# EAGLE board TRS-80 (EAGLE 6.6.0)
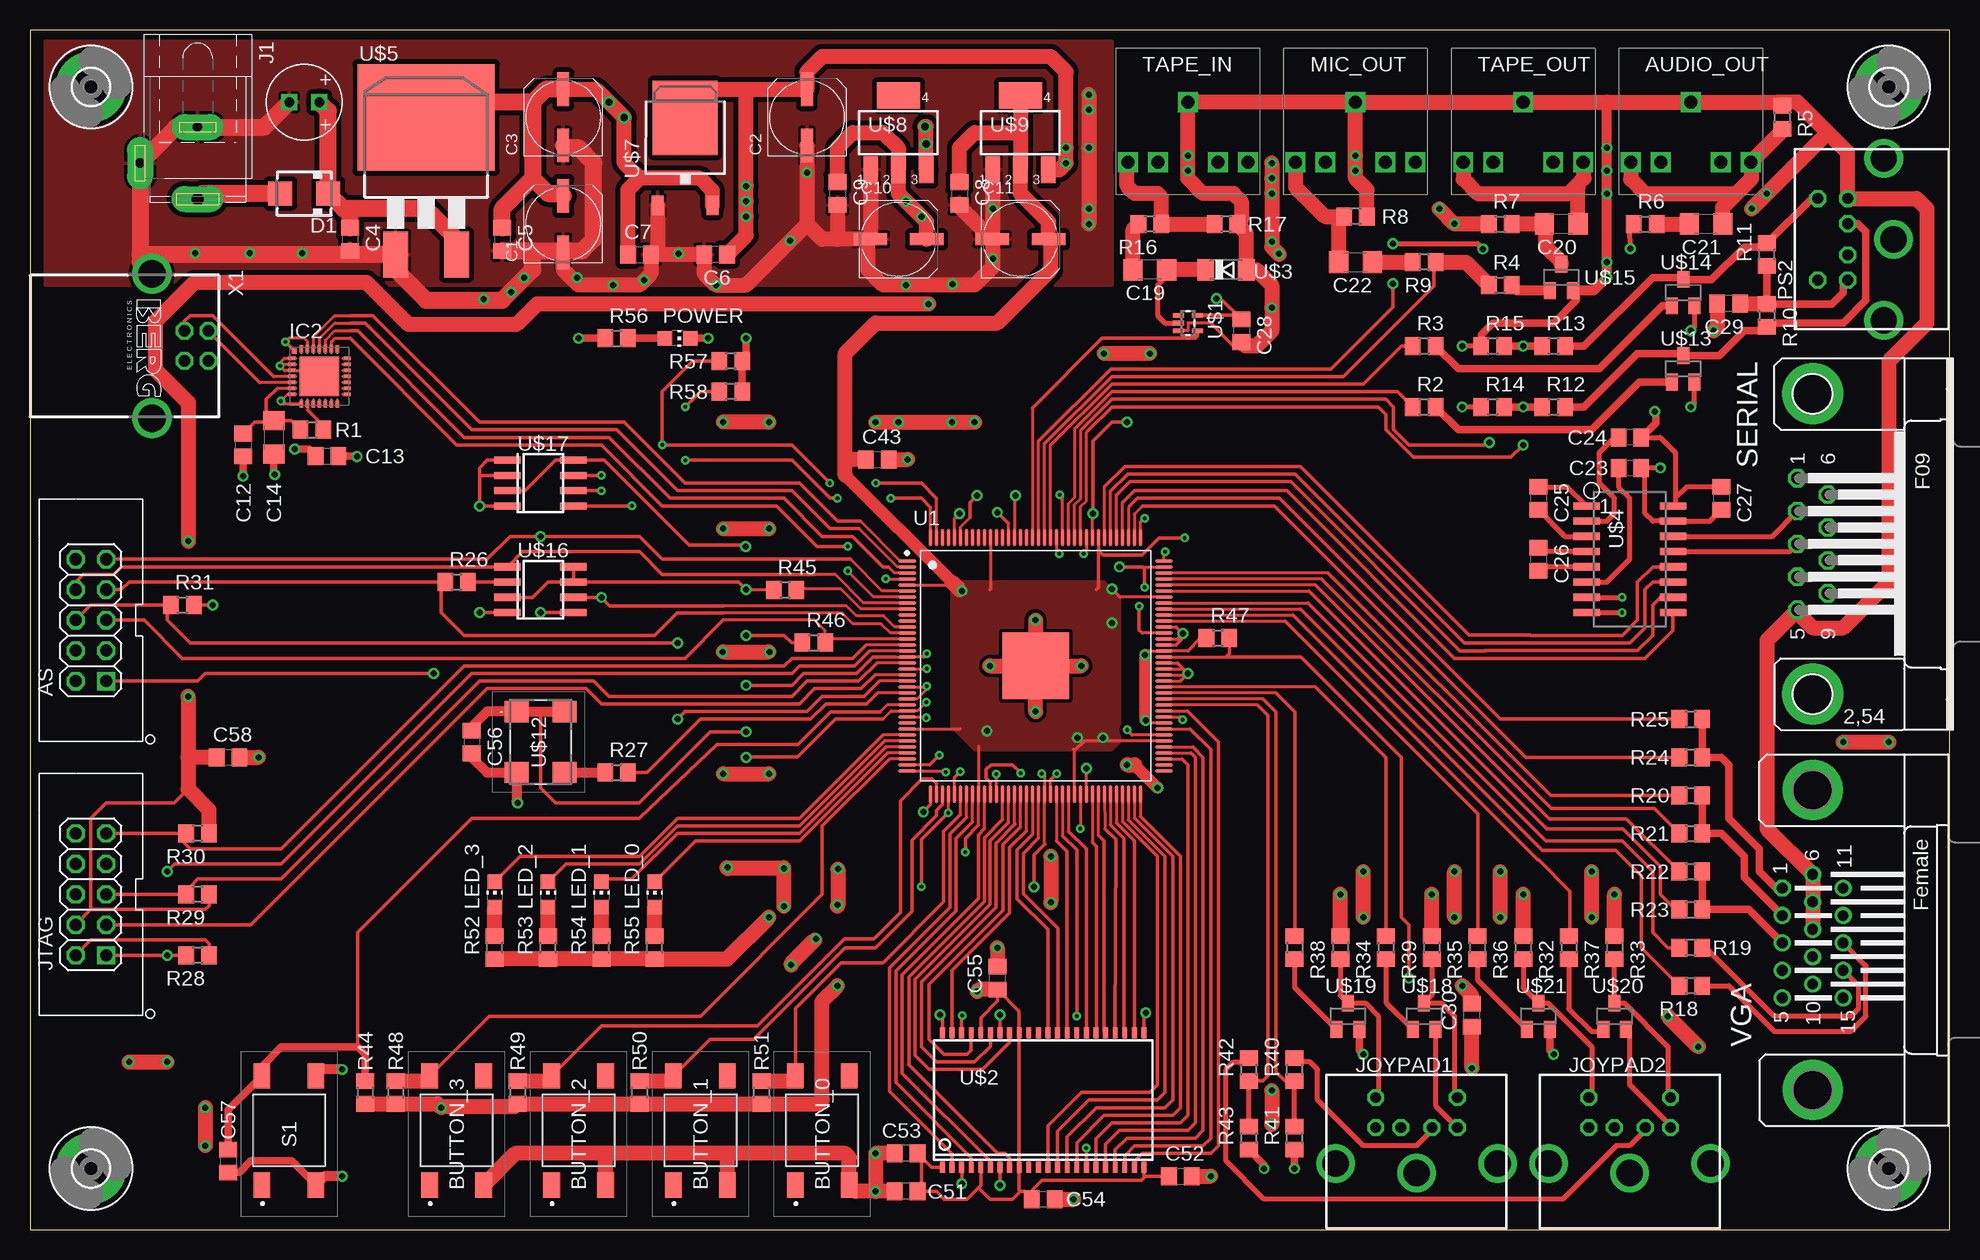
[diagram p1: board, top side]
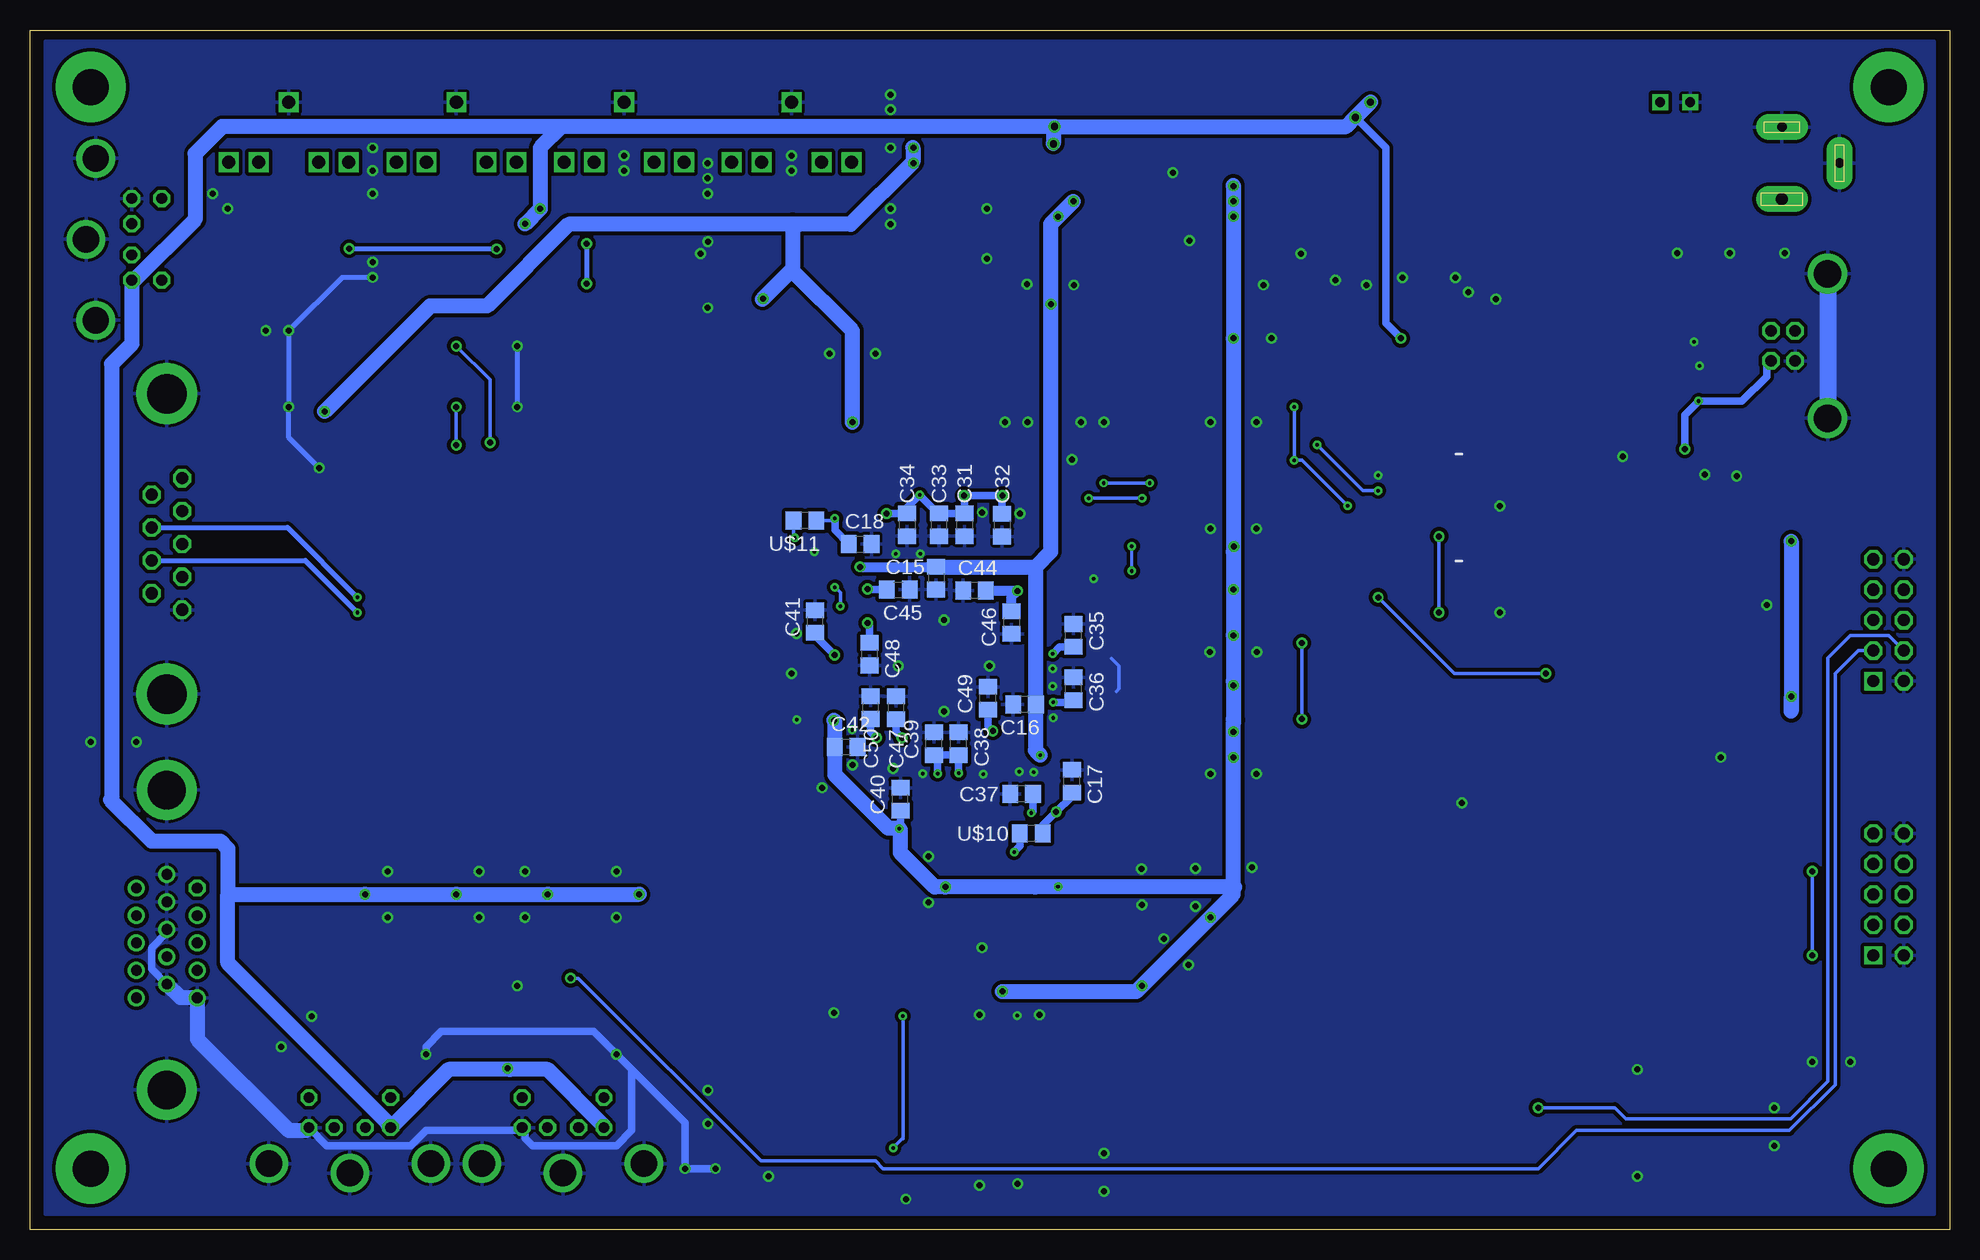
[diagram p2: board, bottom side, seen from below]

Size 160 x 100 mm. Coordinates in mm from the lower left corner, seen from the top.
Outline: 0,0 160,0 160,100 0,100 0,0
Copper layers (1*16): Top 0.035mm / dielectric 1.5mm / Bottom 0.035mm
Design rules "JLC": minimum track width 5mil, minimum drill 0.2mm, track to track 5mil, track to pad 0.2mm, pad to pad 5mil, via to via 0.54mm, smd to smd 0.003225mm, copper to edge 0.2mm, drill to drill 0.54mm, minimum pad ring 10mil, minimum via ring 8mil, stop-mask expansion 4mil, vias tented up to drill 0mil, thermal gap 10mil

## Footprints (pad centres in the part's own frame; a part is rotated, then mirrored left to right if it is on the bottom)
2X05 = drill 1.016 square: 1 -5.08,-1.27 | drill 1.016 octagon: 2 -5.08,1.27; 3 -2.54,-1.27; 4 -2.54,1.27; 5 0,-1.27; 6 0,1.27; 7 2.54,-1.27; 8 2.54,1.27; 9 5.08,-1.27; 10 5.08,1.27
3.5_AUDIO = drill 1.1 square: RING 5,-5; RING_SWITCH 2.5,-5; SLEEVE 0,0; TIP -5,-5; TIP_SWITCH -2.5,-5
LL3301NF065QG = smd 2.1 x 1.4: 1 -4.55,2.25; 2 4.55,2.25; 3 -4.55,-2.25; 4 4.55,-2.25
UD-6,3X5,8_NICHICON = smd 2.8 x 1: + 2.35,0; - -2.35,0
C0805 = smd 1.3 x 1.5: 1 -0.95,0; 2 0.95,0
C1206 = smd 1.6 x 1.8: 1 -1.4,0; 2 1.4,0
SMA = smd 2 x 2: A 2,0; C -2,0
3,0-PAD = drill 3 pad 5.842: B3,0 0,0
MLP28 = smd 0.6 x 0.3: 1 -2.3,1.5; 2 -2.3,1; 3 -2.3,0.5; 4 -2.3,0; 5 -2.3,-0.5; 6 -2.3,-1; 7 -2.3,-1.5; 15 2.3,-1.5; 16 2.3,-1; 17 2.3,-0.5; 18 2.3,0; 19 2.3,0.5; 20 2.3,1; 21 2.3,1.5 | smd 0.3 x 0.6: 8 -1.5,-2.3; 9 -1,-2.3; 10 -0.5,-2.3; 11 0,-2.3; 12 0.5,-2.3; 13 1,-2.3; 14 1.5,-2.3; 22 1.5,2.3; 23 1,2.3; 24 0.5,2.3; 25 0,2.3; 26 -0.5,2.3; 27 -1,2.3; 28 -1.5,2.3 | smd 3.3 x 3.3: EXP 0,0 | smd 0.435 x 0.435: M -2.103,2.103
SPC4078 = drill 0.8 pad 2.184 long: 1 -3,0; 2 0,-4.8 | drill 1 pad 2.184 long: 3 3,0
MDIN06SS = drill 0.9 octagon: 1 1.3,8.5; 2 -1.3,8.5; 3 3.4,8.5; 4 -3.4,8.5; 5 3.4,11; 6 -3.4,11 | drill 2.2 pad 2.6: S1 -6.75,5.5; S2 0,4.7; S3 6.75,5.5
CHIP-LED0805 = smd 1.2 x 1.2: A 0,-1.05; C 0,1.05
R0805 = smd 1.3 x 1.5: 1 -0.95,0; 2 0.95,0
F09HP = drill 1.016 octagon: 1 -5.486,-1.27; 2 -2.743,-1.27; 3 0,-1.27; 4 2.743,-1.27; 5 5.486,-1.27; 6 -4.115,1.27; 7 -1.372,1.27; 8 1.372,1.27; 9 4.115,1.27 | drill 3.302 pad 5.08: G1 -12.522,0; G2 12.522,0
QFP50P2200X2200X165-145N = smd 1.5 x 0.3: 1 -10.7,8.75; 2 -10.7,8.25; 3 -10.7,7.75; 4 -10.7,7.25; 5 -10.7,6.75; 6 -10.7,6.25; 7 -10.7,5.75; 8 -10.7,5.25; 9 -10.7,4.75; 10 -10.7,4.25; 11 -10.7,3.75; 12 -10.7,3.25; 13 -10.7,2.75; 14 -10.7,2.25; 15 -10.7,1.75; 16 -10.7,1.25; 17 -10.7,0.75; 18 -10.7,0.25; 19 -10.7,-0.25; 20 -10.7,-0.75; 21 -10.7,-1.25; 22 -10.7,-1.75; 23 -10.7,-2.25; 24 -10.7,-2.75; 25 -10.7,-3.25; 26 -10.7,-3.75; 27 -10.7,-4.25; 28 -10.7,-4.75; 29 -10.7,-5.25; 30 -10.7,-5.75; 31 -10.7,-6.25; 32 -10.7,-6.75; 33 -10.7,-7.25; 34 -10.7,-7.75; 35 -10.7,-8.25; 36 -10.7,-8.75; 73 10.7,-8.75; 74 10.7,-8.25; 75 10.7,-7.75; 76 10.7,-7.25; 77 10.7,-6.75; 78 10.7,-6.25; 79 10.7,-5.75; 80 10.7,-5.25; 81 10.7,-4.75; 82 10.7,-4.25; 83 10.7,-3.75; 84 10.7,-3.25; 85 10.7,-2.75; 86 10.7,-2.25; 87 10.7,-1.75; 88 10.7,-1.25; 89 10.7,-0.75; 90 10.7,-0.25; 91 10.7,0.25; 92 10.7,0.75; 93 10.7,1.25; 94 10.7,1.75; 95 10.7,2.25; 96 10.7,2.75; 97 10.7,3.25; 98 10.7,3.75; 99 10.7,4.25; 100 10.7,4.75; 101 10.7,5.25; 102 10.7,5.75; 103 10.7,6.25; 104 10.7,6.75; 105 10.7,7.25; 106 10.7,7.75; 107 10.7,8.25; 108 10.7,8.75 | smd 0.3 x 1.5: 37 -8.75,-10.7; 38 -8.25,-10.7; 39 -7.75,-10.7; 40 -7.25,-10.7; 41 -6.75,-10.7; 42 -6.25,-10.7; 43 -5.75,-10.7; 44 -5.25,-10.7; 45 -4.75,-10.7; 46 -4.25,-10.7; 47 -3.75,-10.7; 48 -3.25,-10.7; 49 -2.75,-10.7; 50 -2.25,-10.7; 51 -1.75,-10.7; 52 -1.25,-10.7; 53 -0.75,-10.7; 54 -0.25,-10.7; 55 0.25,-10.7; 56 0.75,-10.7; 57 1.25,-10.7; 58 1.75,-10.7; 59 2.25,-10.7; 60 2.75,-10.7; 61 3.25,-10.7; 62 3.75,-10.7; 63 4.25,-10.7; 64 4.75,-10.7; 65 5.25,-10.7; 66 5.75,-10.7; 67 6.25,-10.7; 68 6.75,-10.7; 69 7.25,-10.7; 70 7.75,-10.7; 71 8.25,-10.7; 72 8.75,-10.7; 109 8.75,10.7; 110 8.25,10.7; 111 7.75,10.7; 112 7.25,10.7; 113 6.75,10.7; 114 6.25,10.7; 115 5.75,10.7; 116 5.25,10.7; 117 4.75,10.7; 118 4.25,10.7; 119 3.75,10.7; 120 3.25,10.7; 121 2.75,10.7; 122 2.25,10.7; 123 1.75,10.7; 124 1.25,10.7; 125 0.75,10.7; 126 0.25,10.7; 127 -0.25,10.7; 128 -0.75,10.7; 129 -1.25,10.7; 130 -1.75,10.7; 131 -2.25,10.7; 132 -2.75,10.7; 133 -3.25,10.7; 134 -3.75,10.7; 135 -4.25,10.7; 136 -4.75,10.7; 137 -5.25,10.7; 138 -5.75,10.7; 139 -6.25,10.7; 140 -6.75,10.7; 141 -7.25,10.7; 142 -7.75,10.7; 143 -8.25,10.7; 144 -8.75,10.7 | smd 5.55 x 5.55: 145 0,0
SOT353 = smd 0.4 x 0.9: 1 -0.65,-0.8; 2 0,-0.8; 3 0.65,-0.8; 4 0.65,0.8; 5 -0.65,0.8
TSOP44-II = smd 0.4 x 0.9: 1 -8.4,-5.6; 2 -7.6,-5.6; 3 -6.8,-5.6; 4 -6,-5.6; 5 -5.2,-5.6; 6 -4.4,-5.6; 7 -3.6,-5.6; 8 -2.8,-5.6; 9 -2,-5.6; 10 -1.2,-5.6; 11 -0.4,-5.6; 12 0.4,-5.6; 13 1.2,-5.6; 14 2,-5.6; 15 2.8,-5.6; 16 3.6,-5.6; 17 4.4,-5.6; 18 5.2,-5.6; 19 6,-5.6; 20 6.8,-5.6; 21 7.6,-5.6; 22 8.4,-5.6; 23 8.4,5.6; 24 7.6,5.6; 25 6.8,5.6; 26 6,5.6; 27 5.2,5.6; 28 4.4,5.6; 29 3.6,5.6; 30 2.8,5.6; 31 2,5.6; 32 1.2,5.6; 33 0.4,5.6; 34 -0.4,5.6; 35 -1.2,5.6; 36 -2,5.6; 37 -2.8,5.6; 38 -3.6,5.6; 39 -4.4,5.6; 40 -5.2,5.6; 41 -6,5.6; 42 -6.8,5.6; 43 -7.6,5.6; 44 -8.4,5.6
SOD80C = smd 1.4 x 1.8: A 1.7,0; C -1.7,0
SOP16 = smd 0.6 x 2.2: 1 -4.445,-3.6; 2 -3.175,-3.6; 3 -1.905,-3.6; 4 -0.635,-3.6; 5 0.635,-3.6; 6 1.905,-3.6; 7 3.175,-3.6; 8 4.445,-3.6; 9 4.445,3.6; 10 3.175,3.6; 11 1.905,3.6; 12 0.635,3.6; 13 -0.635,3.6; 14 -1.905,3.6; 15 -3.175,3.6; 16 -4.445,3.6
D2PACK = smd 2.083 x 3.81: 1 -2.54,-8.89; 3 2.54,-8.89 | smd 11.43 x 8.89: 2 0,2.54
NXA_35V100_6.3X11 = drill 0.8 square: P$1 -1.25,0; P$2 1.25,0
TO252 = smd 1 x 1.6: 1 -2.28,-4.8; 3 2.28,-4.8 | smd 5.4 x 6.2: 2 0,2.5
SOT223 = smd 1.219 x 2.235: 1 -2.311,-3.099; 2 0,-3.099; 3 2.311,-3.099 | smd 3.6 x 2.2: 4 0,3.099
ASV32000MHZET = smd 1.78 x 2: 1 -2.54,-2; 2 2.54,-2; 3 2.54,2; 4 -2.54,2
SOT23 = smd 1 x 1.4: 1 -0.95,-1.1; 2 0.95,-1.1; 3 0,1.1
SO08 = smd 0.6 x 2.2: 1 -1.905,-2.75; 2 -0.635,-2.75; 3 0.635,-2.75; 4 1.905,-2.75; 5 1.905,2.75; 6 0.635,2.75; 7 -0.635,2.75; 8 -1.905,2.75
HDF15H = drill 0.9 octagon: 1 4.329,2.54 | drill 0.9: 2 2.043,2.54; 3 -0.243,2.54; 4 -2.529,2.54; 5 -4.815,2.54; 6 5.472,0; 7 3.186,0; 8 0.9,0; 9 -1.386,0; 10 -3.672,0; 11 4.329,-2.54; 12 2.043,-2.54; 13 -0.243,-2.54; 14 -2.529,-2.54; 15 -4.815,-2.54 | drill 3.18 pad 5: S1 -12.5,0; S2 12.5,0
PN61729-S = drill 0.95 octagon: 1 1.25,4.71; 2 -1.25,4.71; 3 -1.25,2.71; 4 1.25,2.71 | drill 2.3 pad 2.9: S1 -6.02,0; S2 6.02,0

## Placement (x,y rotation side)
AS  [2X05]  5.08,50.8 90 top
AUDIO_OUT  3.5_AUDIO  [3.5_AUDIO]  138.43,93.98 0 top
BUTTON_0  LL3301NF065QG  [LL3301NF065QG]  66.04,8.26 90 top
BUTTON_1  LL3301NF065QG  [LL3301NF065QG]  55.88,8.26 90 top
BUTTON_2  LL3301NF065QG  [LL3301NF065QG]  45.72,8.26 90 top
BUTTON_3  LL3301NF065QG  [LL3301NF065QG]  35.56,8.26 90 top
C1  100u  [UD-6,3X5,8_NICHICON]  44.45,83.82 90 top
C2  100u  [UD-6,3X5,8_NICHICON]  64.77,92.71 90 top
C3  100u  [UD-6,3X5,8_NICHICON]  44.45,92.71 90 top
C4  104  [C0805]  26.67,82.55 270 top
C5  104  [C0805]  39.37,82.55 270 top
C6  104  [C0805]  57.15,81.28 180 top
C7  104  [C0805]  50.8,81.28 0 top
C8  104  [C0805]  77.47,86.36 270 top
C9  104  [C0805]  67.31,86.36 270 top
C10  100u  [UD-6,3X5,8_NICHICON]  72.39,82.55 0 top
C11  100u  [UD-6,3X5,8_NICHICON]  82.55,82.55 0 top
C12  104  [C0805]  17.78,65.41 270 top
C13  104  [C0805]  24.77,64.48 0 top
C14  106  [C1206]  20.32,66.04 270 top
C15  104  [C0805]  84.46,54.3 270 bottom
C16  104  [C0805]  77.1,43.78 180 bottom
C17  104  [C0805]  73.16,37.38 90 bottom
C18  104  [C0805]  90.81,57.15 0 bottom
C19  106  [C1206]  93.34,80.01 180 top
C20  106  [C1206]  127.64,83.82 180 top
C21  106  [C1206]  139.7,83.82 180 top
C22  106  [C1206]  110.49,80.64 0 top
C23  104  [C0805]  133.35,63.5 0 top
C24  104  [C0805]  133.35,66.04 180 top
C25  104  [C0805]  125.73,60.96 270 top
C26  104  [C0805]  125.73,55.88 270 top
C27  104  [C0805]  140.97,60.96 270 top
C28  104  [C0805]  100.97,74.93 270 top
C29  104  [C0805]  141.59,77.18 180 top
C30  104  [C0805]  120.19,17.87 90 top
C31  104  [C0805]  82.11,58.75 270 bottom
C32  104  [C0805]  78.97,58.72 270 bottom
C33  104  [C0805]  84.25,58.74 270 bottom
C34  104  [C0805]  86.89,58.74 270 bottom
C35  104  [C0805]  73.03,49.53 90 bottom
C36  104  [C0805]  73.03,45.09 90 bottom
C37  104  [C0805]  77.35,36.3 180 bottom
C38  104  [C0805]  82.6,40.5 90 bottom
C39  104  [C0805]  84.65,40.5 90 bottom
C40  104  [C0805]  87.45,35.88 90 bottom
C41  104  [C0805]  94.55,50.69 90 bottom
C42  104  [C0805]  91.97,40.25 0 bottom
C43  104  [C0805]  70.62,64.2 0 top
C44  104  [C0805]  81.27,53.27 180 bottom
C45  104  [C0805]  87.63,53.34 0 bottom
C46  104  [C0805]  78.18,50.6 270 bottom
C47  104  [C0805]  87.8,43.51 90 bottom
C48  104  [C0805]  90.04,47.97 270 bottom
C49  104  [C0805]  80.16,44.28 90 bottom
C50  104  [C0805]  89.92,43.52 90 bottom
C51  104  [C0805]  73.03,3.17 180 top
C52  104  [C0805]  95.89,4.45 0 top
C53  104  [C0805]  73.03,6.35 180 top
C54  104  [C0805]  84.45,2.54 0 top
C55  104  [C0805]  80.64,20.95 90 top
C56  104  [C0805]  36.83,40.64 270 top
C57  104  [C0805]  16.51,5.71 270 top
C58  104  [C0805]  16.51,39.37 0 top
D1  MBRA340T3  [SMA]  22.86,86.36 180 top
H1  MOUNT-PAD-ROUND3.0  [3,0-PAD]  5.08,5.08 0 top
H2  MOUNT-PAD-ROUND3.0  [3,0-PAD]  5.08,95.25 0 top
H3  MOUNT-PAD-ROUND3.0  [3,0-PAD]  154.94,95.25 0 top
H4  MOUNT-PAD-ROUND3.0  [3,0-PAD]  154.94,5.08 0 top
IC2  CP2102  [MLP28]  24.13,71.12 0 top
J1  [SPC4078]  13.97,88.9 270 top
JOYPAD1  [MDIN06SS]  115.57,0 0 top
JOYPAD2  [MDIN06SS]  133.35,0 0 top
JTAG  [2X05]  5.08,27.94 90 top
LED_0  LED_0805  [CHIP-LED0805]  52.07,27.94 0 top
LED_1  LED_0805  [CHIP-LED0805]  47.62,27.94 0 top
LED_2  LED_0805  [CHIP-LED0805]  43.18,27.94 0 top
LED_3  LED_0805  [CHIP-LED0805]  38.73,27.94 0 top
MIC_OUT  3.5_AUDIO  [3.5_AUDIO]  110.49,93.98 0 top
POWER  LED_0805  [CHIP-LED0805]  53.98,74.3 270 top
PS2  [MDIN06SS]  160.02,82.55 90 top
R1  10k  [R0805]  23.5,66.67 0 top
R2  5k6  [R0805]  116.2,68.58 0 top
R3  5k6  [R0805]  116.2,73.66 0 top
R4  5k6  [R0805]  122.56,78.74 0 top
R5  5k6  [R0805]  146.05,92.71 270 top
R6  10k  [R0805]  134.62,83.82 0 top
R7  1k  [R0805]  122.56,83.82 0 top
R8  1k  [R0805]  110.49,84.45 180 top
R9  10k  [R0805]  116.2,80.64 180 top
R10  1k  [R0805]  144.78,76.2 270 top
R11  1k  [R0805]  144.78,81.28 90 top
R12  5k6  [R0805]  127,68.58 0 top
R13  5k6  [R0805]  127,73.66 0 top
R14  10k  [R0805]  121.92,68.58 0 top
R15  10k  [R0805]  121.92,73.66 0 top
R16  510  [R0805]  93.34,83.82 180 top
R17  1k  [R0805]  99.69,83.82 180 top
R18  75  [R0805]  138.43,20.32 180 top
R19  75  [R0805]  138.43,23.5 180 top
R20  1k  [R0805]  138.43,36.2 0 top
R21  510  [R0805]  138.43,33.02 0 top
R22  1k  [R0805]  138.43,29.84 0 top
R23  510  [R0805]  138.43,26.67 0 top
R24  510  [R0805]  138.43,39.37 0 top
R25  1k  [R0805]  138.43,42.55 0 top
R26  33  [R0805]  35.56,53.98 0 top
R27  33  [R0805]  48.9,38.1 0 top
R28  1k  [R0805]  13.97,22.86 180 top
R29  10k  [R0805]  13.97,27.94 180 top
R30  10k  [R0805]  13.97,33.02 180 top
R31  10k  [R0805]  12.7,52.07 0 top
R32  1k  [R0805]  124.46,23.5 270 top
R33  1k  [R0805]  132.08,23.5 270 top
R34  1k  [R0805]  109.22,23.5 270 top
R35  1k  [R0805]  116.84,23.5 270 top
R36  5k6  [R0805]  120.65,23.5 270 top
R37  5k6  [R0805]  128.27,23.5 270 top
R38  5k6  [R0805]  105.41,23.5 270 top
R39  5k6  [R0805]  113.03,23.5 270 top
R40  5k6  [R0805]  105.41,13.34 90 top
R41  10k  [R0805]  105.41,7.62 90 top
R42  5k6  [R0805]  101.6,13.34 90 top
R43  10k  [R0805]  101.6,7.62 90 top
R44  10k  [R0805]  27.94,11.43 270 top
R45  10k  [R0805]  62.94,53.33 0 top
R46  10k  [R0805]  65.33,48.92 0 top
R47  10k  [R0805]  99.01,49.31 0 top
R48  10k  [R0805]  30.48,11.43 270 top
R49  10k  [R0805]  40.64,11.43 270 top
R50  10k  [R0805]  50.8,11.43 270 top
R51  10k  [R0805]  60.96,11.43 270 top
R52  470  [R0805]  38.73,23.5 90 top
R53  470  [R0805]  43.18,23.5 90 top
R54  470  [R0805]  47.62,23.5 90 top
R55  470  [R0805]  52.07,23.5 90 top
R56  2k2  [R0805]  48.9,74.3 0 top
R57  5K6  [R0805]  58.42,72.39 180 top
R58  5K6  [R0805]  58.42,69.85 180 top
S1  LL3301NF065QG  [LL3301NF065QG]  21.59,8.26 90 top
SERIAL  [F09HP]  148.59,57.15 270 top
TAPE_IN  3.5_AUDIO  [3.5_AUDIO]  96.52,93.98 0 top
TAPE_OUT  3.5_AUDIO  [3.5_AUDIO]  124.46,93.98 0 top
U1  EP4CE6E22C8N  [QFP50P2200X2200X165-145N]  83.82,46.99 0 top
U$1  74LVC1G17  [SOT353]  96.52,75.56 270 top
U$2  TMS626812  [TSOP44-II]  84.45,10.79 0 top
U$3  ZMM2V2  [SOD80C]  99.69,80.01 0 top
U$4  SP232  [SOP16]  133.35,55.88 270 top
U$5  LM1086  [D2PACK]  33.02,90.17 0 top
U$6  NXA_35V100_6.3X11  [NXA_35V100_6.3X11]  22.86,93.98 0 top
U$7  LD1117D-3.3  [TO252]  54.61,90.17 0 top
U$8  KIA1117-2.5  [SOT223]  72.39,91.44 0 top
U$9  AZ1117H-1.2TRG1  [SOT223]  82.55,91.44 0 top
U$10  CBG201209U601T  [C0805]  76.53,33.02 180 bottom
U$11  CBG201209U601T  [C0805]  95.41,59.09 180 bottom
U$12  OT705050MJBA4SL  [ASV32000MHZET]  42.55,40.64 270 top
U$13  PMBT3904  [SOT23]  137.79,71.75 0 top
U$14  PMBT3904  [SOT23]  137.79,78.11 0 top
U$15  PMBT3904  [SOT23]  127.64,79.38 0 top
U$16  BY25Q16BS  [SO08]  42.55,53.34 270 top
U$17  CAT24M01WI-GT3  [SO08]  42.55,62.23 270 top
U$18  PMBT3904  [SOT23]  116.2,17.78 0 top
U$19  PMBT3904  [SOT23]  109.86,17.78 0 top
U$20  PMBT3904  [SOT23]  132.08,17.78 0 top
U$21  PMBT3904  [SOT23]  125.73,17.78 0 top
VGA  [HDF15H]  148.59,24.13 90 top
X1  PN61729-S  [PN61729-S]  10.16,73.66 270 top

## Tracks (layer width: path | path; a pad name or v marks a point on that pad's centre or on a via)
1V2  (via drill 0.3, 0.5)
  Top 0.254: U1.116 89.07,56.63 | U1.134 80.07,53.4 | U1.5 76.6,53.74 | U1.61 87.07,39.93 | U1.78 87.88,40.74 | U1.29 77.56,41.74 | U1.102 90.86,52.74 | U1.45 79.05,36.3 | 79.07,40.31 U1.45 | 79.07,33.72 U1.45
  Top 0.305: 88.9,53.34 89.07,53.51 89.07,56.63 89.45,56.25 92.7,56.25 94.1,57.65 v96.25,57.65 | 80.07,53.4 80.01,53.34 | 76.6,53.74 76.83,53.98 | 87,40.01 87.07,39.93 87.88,40.74 | 90.86,52.74 v90.2,53.4 | v77.97,31.47 77.97,32.62 79.07,33.72
  Top 1.016: 76.83,53.98 67.94,62.87
  Top 1.27: U$9.4 82.55,91.44 | 82.55,91.44 U$9.2 82.55,86.36 84.9,84.01 C11.+ 85.09,82.36 85.09,80.01 80.64,75.56 70.48,75.56 67.94,73.03 67.94,64.14 | C8.1 77.47,90.17 78.74,91.44 82.55,91.44 | 77.47,53.34 76.83,53.98 | 67.94,62.87 67.94,64.14 | C43.1 68.01,64.2 67.94,64.14
  Bottom 0.305: U$11.2 96.36,57.76 v96.25,57.65
  Bottom 0.61: C45.1 90.14,53.34 v90.2,53.4 | C48.1 90.04,50.39 v90.2,50.55 | C50.1 89.92,41.47 v89.45,41 | C49.1 80.16,41.96 v79.75,41.55 | C47.1 87.8,41.49 v87.3,41 | U$10.2 77.48,31.96 v77.97,31.47
  Bottom 0.813: C46.1 78.18,52.77 v77.7,53.25 77.72,53.27 C44.1
  pour Top (isolate 0.305): 76.83,53.98 76.83,41.91 78.74,40.01 87,40.01 90.17,40.01 90.81,40.64 90.81,52.7 90.17,53.34 89.53,53.98
2V5  (via drill 0.3, 0.5)
  Top 0.254: 92.71,55.24 U1.107 | U1.96 92.71,49.74 | 74.98,38.73 U1.35
  Top 0.305: v90.81,55.24 92.71,55.24 92.9,55.05 v92.9,53.55 | 92.71,49.74 92.45,50 v92.45,51.95 | JTAG.4 5.08,26.67 | 5.08,26.67 5.08,34.29 6.35,35.56 12.03,35.56 13.19,36.72 | R29.1 14.92,26.98 14.61,26.67 5.08,26.67 | 74.98,38.73 v75.78,39.53
  Top 1.27: C9.1 67.31,90.17 68.58,91.44 71.12,91.44 72.39,90.17 U$8.2 72.39,86.36 v73.03,85.72 v74.3,84.45 74.74,84.01 C10.+ | v74.9,77.15 42.25,77.15 40.55,75.45 31.55,75.45 28.05,78.95 13.7,78.95 10.45,75.7 10.45,71.7 13.2,68.95 v13.2,57.39 | v13.19,44.45 13.19,39.37 | 13.19,39.37 13.19,36.72 14.9,35 14.9,33.04 R30.1 | C58.1 13.19,39.37
  Bottom 0.305: v92.45,51.95 92.45,53.1 v92.9,53.55
  Bottom 0.61: 84.45,55.24 C15.1 84.47,55.24 | 76.2,55.25 76.2,55.24 | v74.9,77.15 74.9,76.86 74.93,76.83
  Bottom 0.813: C16.1 76.17,43.78 76.2,43.81 | v90.81,55.24 84.47,55.24
  Bottom 1.27: v73.03,85.72 v74.3,84.45 74.93,83.82 74.93,76.83 74.93,56.52 76.2,55.24 76.2,43.81 76.2,39.95 v75.78,39.53 | C15.1 76.2,55.25 | v13.2,57.39 13.2,43.2 v13.19,44.45
3V3  (via drill 0.3, 0.5)
  Top 0.254: U1.139 77.57,58.57 78.35,59.35 | U1.117 88.57,59.67 | U1.62 87.57,33.66 | U1.81 93.21,42.24 | U1.122 86.07,61.03 v85.85,61.25 | 59.7,39.38 v59.69,39.37 | 71.1,42.55 71.79,43.24 U1.26 73.99,43.24 v74.7,43.95 | R45.1 59.7,53.33 v59.69,53.34 | 63.47,48.92 R46.1 | U1.47 80.07,37.28 | v92.95,47.9 93.29,48.24 U1.93 96.5,48.24 | 92.95,42.5 v93,42.45 | 84.6,32.15 84.57,32.18 U1.56 84.57,37.78 | 76.57,34.77 U1.40 | 72.14,47.74 U1.17 74.49,47.74 | 82.05,61.1 82.07,61.08 U1.130 | v135.45,68.2 135.45,68 135.5,67.94
  Top 0.305: C51.1 74.3,3.17 | U$2.5 79.25,3.69 79.06,3.49 | 79.06,3.49 78.11,2.54 76.2,2.54 75.56,3.17 74.3,3.17 | U$2.1 75.13,5.2 C53.1 74.3,6.03 74.3,3.17 | U$2.40 79.25,17.66 80.64,19.05 C55.1 82.45,18.2 U$2.36 U$2.9 82.45,3.27 82.55,3.17 | 82.55,3.17 81.92,2.54 80.01,2.54 79.06,3.49 | 82.55,3.17 82.87,3.17 C54.1 83.6,2.63 83.6,3.35 84.35,4.1 92.65,4.1 92.86,4.3 92.86,4.45 | U$2.22 92.86,4.45 | C52.1 92.86,4.45 | v91.44,67.31 90.17,67.31 88.6,65.74 v88.6,59.7 88.57,59.67 | v87.55,33.4 87.55,33.63 87.57,33.66 | 74.49,47.74 v74.75,48 | 93.21,42.24 v93,42.45 | 82.05,61.1 v82.15,61.2 | 78.35,59.35 78.35,60.6 v78.95,61.2 | 63.47,48.92 62.87,49.53 v59.69,49.53 | v59.69,45.37 63.5,45.37 64.48,46.35 68.88,46.35 70.28,47.75 72.13,47.75 72.14,47.74 | R47.1 97.57,49.31 96.5,48.24 | v34.29,10.16 34.39,10.26 | 42.55,43.18 42.55,36.83 43.81,35.56 50.76,35.56 56.7,41.5 v59.7,41.5 | U$16.7 U$16.8 | U$16.7 59.05,53.98 v59.69,53.34 | U$16.3 41.91,52.7 43.18,53.98 U$16.7 | v59.65,56.95 59.55,57.05 54.95,57.05 47.87,64.14 U$17.8 43.81,64.14 41.27,61.59 U$17.3 | 71.1,42.55 67.15,42.55 63.98,39.38 59.7,39.38 | 80.07,37.28 79.7,37.65 79.7,38.35 80.1,38.75 81.9,38.75 v82.6,38.05 | 84.57,37.78 v84.35,38 | 84.6,32.15 83.7,31.25 v83.7,28.55 | 99.06,77.6 99.25,77.6 C28.1 | 100.52,76.33 C28.1 | U$1.5 100.63,76.22 C28.1 | v74.31,28.58 74.31,32.51 v76.53,34.73 76.57,34.77
  Top 0.406: C24.1 135.89,66.04 137.16,64.77 137.16,60.96 | 137.16,60.96 137.16,60.53 U$4.16 | C27.1 138.11,61.91 137.16,60.96
  Top 0.61: v98.9,77.6 99.06,77.6 | 135.5,68.15 135.5,67.94 135.5,67.24 C24.1 | R58.1 R57.1 59.69,72.39 v59.69,74.3
  Top 0.813: C56.1 36.83,41.91 38.1,43.18 U$12.1 42.55,43.18 U$12.4
  Top 1.016: v92.95,47.9 92.95,42.5
  Top 1.27: U$7.2 57,95.06 59.69,95.06 | 59.69,95.06 C2.+ 64.77,96.52 66.04,97.79 85.09,97.79 86.36,96.52 v86.36,90.17 v86.36,88.9 85.8,88.34 U$9.3 | C6.1 59.69,82.87 v59.69,84.45 v59.69,85.72 v59.69,87 59.69,95.06 | C55.1 79.11,20 v78.95,19.85 | v34.29,10.16 33.97,10.48 R48.2 R44.2 | 34.39,10.26 40.42,10.26 R49.2 R50.2 R51.2 65.72,10.48 66.04,10.79 66.04,19.05 v67.31,20.32 | v61.59,26.04 58.1,22.55 R55.1 R54.1 R53.1 R52.1
  Bottom 0.254: v59.69,49.53 v59.69,53.34 | v86.36,90.17 v86.37,90.17 86.4,90.2
  Bottom 0.305: 96.45,83.85 95.94,83.85 95.89,83.8 | 59.69,42.55 59.7,42.55 | 59.7,45.71 v59.69,45.37 | v59.69,49.53 v59.7,49.53 | v34.29,10.16 27.91,10.16 27,9.25 13.25,9.25 10.15,12.35 10.15,20.31 | 10.15,20.31 10.16,20.32 | 10.15,20.31 10.15,47.63 8.26,49.53 5.08,49.53 AS.4 | v59.7,41.5 v59.69,41.5 | v59.65,56.95 59.65,56.56 59.7,56.52
  Bottom 0.406: v74.31,28.58 76.22,28.57 76.2,28.55
  Bottom 0.61: C35.1 74.17,48.58 v74.75,48 | C41.1 94.55,49.46 94.51,49.46 v92.95,47.9 | C42.1 92.92,40.02 92.9,40.01 | C40.1 87.45,33.49 v87.55,33.4 | v88.6,59.7 v88.59,59.7 C34.1 86.89,60.2 v85.85,61.25 84.3,59.7 C33.1 C31.1 82.11,61.16 v82.15,61.2 v78.95,61.2 78.97,61.18 C32.1 | v82.6,38.05 C38.1 C39.1 84.35,39.25 v84.35,38 | C37.1 76.4,34.86 v76.53,34.73 | C36.1 73.21,43.95 v74.7,43.95 | v59.69,74.3 v59.7,74.3
  Bottom 1.27: 86.4,90.2 86.4,89 91.6,83.8 95.89,83.8 115.1,83.8 121.9,77 126.65,77 v135.45,68.2 | 96.45,83.85 96.45,80.05 96.5,80 | 96.5,80 v98.9,77.6 98.95,77.55 | v91.44,67.31 91.44,74.93 96.5,80 | 96.52,80.01 96.5,80 | 59.7,87.05 v59.7,87 | v59.7,87 v59.7,74.3 59.7,56.52 v59.7,49.53 59.7,45.71 59.7,42.55 | 59.7,42.55 59.7,42.15 59.69,42.14 v59.69,41.5 v59.69,39.37 59.69,28.55 | v59.69,87 v59.7,87 | 59.65,42.49 59.7,42.55 | v78.95,19.85 67.78,19.85 v67.31,20.32 v61.59,26.04 59.69,27.94 59.69,28.55 | 59.6,28.55 59.69,28.55 | 59.69,28.55 76.2,28.55 v83.7,28.55 84.6,28.55 87.45,31.4 87.45,33.35 87.55,33.45 | 87.55,33.45 88.45,33.45 92.9,37.9 92.9,40.01 92.9,42.35 v93,42.45 | v87.55,33.4 87.55,33.45
5V0  (via drill 0.5, 0.6)
  Top 0.61: PS2.4 151.13,78.76 151.13,78.11 150.18,77.15 R10.1 R11.1 | R56.1 v45.72,74.3
  Top 1.27: U$7.3 56.89,86.62 55.88,87.63 50.8,87.63 | 50.8,87.63 49.53,88.9 v49.53,92.71 v48.26,93.98 47.18,95.06 C3.+ | C7.1 49.85,86.68 50.8,87.63 | U$8.3 74.7,91.95 v74.6,91.95 | R34.1 v109.22,27.94 | R35.1 v116.84,27.94 | R32.1 v124.46,27.94 | R33.1 v132.08,27.94 | R7.1 118.75,83.82 | 118.75,83.82 v117.47,85.09 | 118.75,83.82 118.75,83.83 v118.73,83.84 | C29.1 144.75,77.18 R10.1 | v120.2,13.45 120.2,16.91 C30.1
  Top 1.422: 31.56,95.06 U$5.2 34.29,93.98 41.91,93.98 | C3.+ 42.99,95.06 41.91,93.98 | 41.91,93.98 41.91,87.63 | 41.91,87.63 43.18,86.36 44.26,86.36 C1.+ | C5.1 39.37,85.09 41.91,87.63
  Bottom 0.406: v120.2,13.45 120.13,13.45 120.02,13.34
  Bottom 0.61: v45.72,74.3 46.99,75.56 46.99,90.17 v49.53,92.71 | 74.7,90.55 v74.7,90.5
  Bottom 1.27: v74.6,91.95 50.29,91.95 v49.53,92.71 v48.26,93.98 | v74.6,91.95 74.7,91.95 74.7,90.55 | v74.6,91.95 115.69,91.95 | 115.69,91.95 117.47,90.17 v117.47,85.09 118.75,83.82 | 115.69,91.95 144,91.95 146.25,89.7 146.25,84.2 151.3,79.15 PS2.4 151.52,73.83 153.2,72.15 153.2,35.92 153.3,35.83 149.86,32.38 144.15,32.38 143.51,31.75 143.51,27.94 | 143.51,27.94 143.51,22.23 130.18,8.89 130.18,8.72 JOYPAD2.4 125.11,13.34 120.02,13.34 116.84,13.34 112.17,8.66 JOYPAD1.4 | 143.51,27.94 v132.08,27.94 v124.46,27.94 v116.84,27.94 v109.22,27.94
A0
  Top 0.254: U1.76 96.78,39.74
  Top 0.305: U$2.18 89.66,7.11 90.81,8.26 96.52,8.26 97.16,8.89 97.16,39.37 96.78,39.74
A1
  Top 0.254: U1.77 96.92,40.24
  Top 0.305: U$2.19 90.45,6.63 91.44,7.62 97.16,7.62 97.79,8.26 97.79,39.37 96.92,40.24
A2
  Top 0.254: U1.80 96.69,41.74
  Top 0.305: U$2.20 91.25,6.17 92.08,6.99 97.79,6.99 98.42,7.62 98.42,40.01 96.69,41.74
A3
  Top 0.254: U1.83 96.46,43.24
  Top 0.305: U$2.21 92.06,5.7 92.71,6.35 98.42,6.35 99.06,6.99 99.06,40.64 96.46,43.24
A4
  Top 0.254: U1.68 90.57,33.89
  Top 0.305: 90.57,33.89 92.08,32.38 92.08,16.41 U$2.24
A5
  Top 0.254: U1.67 90.07,33.73
  Top 0.305: 90.07,33.73 91.2,32.59 91.2,16.45 U$2.25
A6
  Top 0.254: U1.66 89.62,33.39
  Top 0.305: 89.62,33.39 90.5,32.51 U$2.26
A7
  Top 0.254: 89.07,32.85 U1.65
  Top 0.305: 89.07,32.85 89.53,32.38 89.53,16.52 U$2.27
A8
  Top 0.254: U1.64 88.57,32.27
  Top 0.305: 88.57,32.27 88.9,31.94 88.9,16.44 U$2.28
A9
  Top 0.254: U1.60 86.57,33.19
  Top 0.305: 86.57,33.19 88.05,31.71 U$2.29
A10
  Top 0.254: U1.75 96.02,39.24
  Top 0.305: U$2.17 88.86,7.58 90.17,8.89 95.89,8.89 96.52,9.53 96.52,38.73 96.02,39.24
ANALOG_IN
  Top 1.27: TAPE_IN.TIP 91.44,88.9 91.44,87 92.08,86.36 93.98,86.36 94.3,86.05 R16.1 R17.2
ASDO  (via drill 0.5)
  Top 0.254: U1.6 71.02,53.24 68.38,55.88
  Top 0.305: 68.38,55.88 52.7,55.88 50.8,57.78 v42.55,57.78 40.01,57.78 38.1,55.88 AS.9 | U$16.5 v42.55,51.44
  Bottom 0.305: v42.55,57.78 v42.55,51.44
AUDIO  (via drill 0.5)
  Top 0.254: U1.126 84.07,65.71
  Top 0.305: v113.6,78.85 113.6,76.9 108.42,71.72 90.08,71.72 84.07,65.71
  Top 0.406: v133.4,81.78 133.35,83.5 R6.1 | v113.6,82.2 120.65,82.2 v121.1,81.75
  Bottom 0.406: v133.4,81.78 121.13,81.78 v121.1,81.75 | v113.6,82.2 v113.6,78.85
B0
  Top 0.254: U1.103 106.61,53.24
  Top 0.305: R23.1 137.16,26.67 135.89,27.94 135.89,30.26 132.75,33.4 126.45,33.4 106.61,53.24
B1
  Top 0.254: 107.15,53.75 107.14,53.74 U1.104
  Top 0.305: 107.15,53.75 126.65,34.25 133.07,34.25 R22.1
BS  (via drill 0.3)
  Top 0.254: U1.59 86.07,32.81
  Top 0.305: 86.07,32.81 87.25,31.63 v87.25,17.8 | U$2.16 v88.06,6.79 v88.05,6.8
  Bottom 0.305: v87.25,17.8 87.25,7.55 87.3,7.55 v88.05,6.8
BUTTON_0
  Top 0.254: 77.57,34.62 U1.42
  Top 0.305: 77.57,34.62 76.15,33.2 76.15,27.3 71.1,22.25 67.6,22.25 63.8,18.45 63.8,12.81 BUTTON_0.2
  Top 1.27: R51.1 63.37,12.38 BUTTON_0.2
BUTTON_1
  Top 0.254: 76.07,35.43 U1.39
  Top 0.305: 76.07,35.43 75.56,34.92 75.56,34.52 73.5,32.45 73.5,26.51 70.48,23.5 67.94,23.5 60.33,15.88 56.7,15.88 BUTTON_1.2
  Top 1.27: R50.1 53.2,12.38 BUTTON_1.2
BUTTON_2
  Top 0.254: U1.38 75.57,37.18
  Top 0.305: 75.57,37.18 75.2,37.55 74.35,37.55 72.55,35.75 72.55,26.45 70.35,24.25 67.9,24.25 60.65,17 47.66,17 BUTTON_2.2
  Top 1.27: R49.1 43.05,12.38 BUTTON_2.2
BUTTON_3
  Top 0.254: U1.34 71.62,39.24
  Top 0.305: 71.62,39.24 66.04,33.66 66.04,27.94 55.88,17.78 38.28,17.78 BUTTON_3.2
  Top 1.27: R48.1 32.88,12.38 BUTTON_3.2
CKE
  Top 0.254: U1.58 85.57,32.41
  Top 0.305: 85.57,32.41 86.45,31.52 U$2.31
CONFIG_DONE  (via drill 0.5)
  Top 0.254: U1.92 99.69,47.74
  Top 0.305: R47.2 99.96,48.01 99.69,47.74 105.93,47.74 114.3,39.37 114.3,26.04 114.94,25.4 v114.94,20.95
  Bottom 0.305: v114.94,20.95 114.3,20.95 99.06,5.71 89.53,5.71 88.9,5.08 34.29,5.08 31.11,8.26 13.34,8.26 9.53,12.06 9.53,46.35 7.62,48.26 AS.3
CP2102_CTS  (via drill 0.3)
  Top 0.254: IC2.23 25.13,74.03 25.4,74.3 26.67,74.3 | U1.7 70.31,52.74 v68.15,54.9
  Top 0.305: v68.15,56.95 65.61,56.95 62.23,60.33 52.7,60.33 47.62,65.41 35.56,65.41 26.67,74.3
  Bottom 0.254: v68.15,54.9 v68.15,56.95
CP2102_RTS
  Top 0.254: IC2.24 24.63,74.16 25.4,74.93 26.67,74.93 | U1.3 72.06,54.74 71.55,55.25
  Top 0.305: 26.67,74.93 27.3,74.93 36.2,66.04 48.26,66.04 53.34,60.96 62.87,60.96 66.04,57.78 68.58,57.78 71.12,55.24 71.12,55.25 71.55,55.25
CP2102_RXD
  Top 0.254: IC2.25 24.13,74.3 25.4,75.56 26.67,75.56 | U1.2 72.3,55.24 69.11,58.42
  Top 0.305: 69.11,58.42 66.67,58.42 63.5,61.59 53.98,61.59 48.9,66.67 36.83,66.67 27.94,75.56 26.67,75.56
CP2102_TXD
  Top 0.254: IC2.26 23.63,74.43 25.4,76.2 26.67,76.2 | U1.1 72.53,55.74 69.22,59.05
  Top 0.305: 69.22,59.05 67.31,59.05 64.14,62.23 54.61,62.23 49.53,67.31 37.47,67.31 28.57,76.2 26.67,76.2
CTS
  Top 0.254: U1.113 90.57,61.22
  Top 0.305: U$4.10 135.89,52.7 135.25,52.07 135.25,49.53 133.99,48.26 121.28,48.26 121.28,48.25 119.2,48.25 105.1,62.35 91.7,62.35 90.57,61.22
DATA
  Top 0.254: U1.13 71.71,49.74 70.95,50.5 68.6,50.5 67.7,51.4 57.8,51.4
  Top 0.305: 57.8,51.4 53.94,51.4 52.07,49.53 36.2,49.53 34.29,51.44 34.29,53.66 R26.1 8.26,53.98 7.62,53.34 AS.7
DCLK  (via drill 0.5)
  Top 0.254: U1.12 72.06,50.24 71.15,51.15 68.9,51.15 68.05,52 57.8,52
  Top 0.305: AS.1 13.97,45.72 14.61,46.35 v33.66,46.35 | 57.8,52 48.33,52 v47.62,52.7 U$16.6
  Bottom 0.305: v33.66,46.35 41.27,46.35 v47.62,52.7
DQ0
  Top 0.254: 78.07,34.37 U1.43
  Top 0.305: U$2.2 76.86,6.33 71.65,11.54 71.65,21.8 76.7,26.85 76.7,33 78.07,34.37
DQ1
  Top 0.254: 78.57,33.97 U1.44
  Top 0.305: U$2.4 78.45,6 72.2,12.26 72.2,21.55 77.2,26.55 77.2,32.6 78.57,33.97
DQ2
  Top 0.254: 79.57,33.42 U1.46
  Top 0.305: U$2.6 80.06,5.67 72.7,13.03 72.7,21.25 79.05,27.6 79.05,32.9 79.57,33.42
DQ3
  Top 0.254: 81.07,34.17 U1.49
  Top 0.305: 81.07,34.17 79.55,32.65 79.55,27.35 73.25,21.05 73.25,13.8 73.22,13.77 80.64,6.35 81.28,6.35 81.66,5.97 U$2.8
DQ4
  Top 0.254: 81.57,33.95 U1.50
  Top 0.305: U$2.37 81.66,15.62 79.38,13.34 74.93,13.34 73.75,14.52 73.75,20.85 80.01,27.11 80.01,32.38 81.57,33.95
DQ5
  Top 0.254: 82.1,33.8 82.07,33.83 U1.51
  Top 0.305: U$2.39 80.06,15.29 78.74,13.97 75.56,13.97 74.3,15.24 74.3,20.64 80.5,26.85 80.5,32.2 82.1,33.8
DQ6
  Top 0.254: 82.55,33.55 82.57,33.57 U1.52
  Top 0.305: U$2.41 78.45,14.96 78.11,14.61 76.2,14.61 74.93,15.88 74.93,20.43 81.1,26.6 81.1,32.1 82.55,33.55
DQ7
  Top 0.254: 83.05,33.25 83.07,33.27 U1.53
  Top 0.305: U$2.43 76.85,21.61 81.65,26.41 81.65,31.85 83.05,33.25
DQM
  Top 0.254: U1.54 83.57,32.92
  Top 0.305: U$2.33 84.85,25 82.25,27.55 82.25,31.65 83.57,32.92
FPGA_CLK
  Top 0.254: U1.23 70.64,44.74
  Top 0.305: R27.2 51.44,38.1 55.88,42.55 65.07,42.55 66.34,43.81 69.72,43.81 70.64,44.74
G0
  Top 0.254: 107.7,54.25 107.69,54.24 U1.105
  Top 0.305: 107.7,54.25 107.7,54.2 126.8,35.1 135.4,35.1 R21.1
G1
  Top 0.254: 108.2,54.75 108.19,54.74 U1.106
  Top 0.305: R20.1 126.75,36.2 108.2,54.75
GND  (via drill 0.3, 0.5)
  Top 0.254: U1.82 95.86,42.74 | U1.108 94.52,56.42 | U1.140 77.07,59.29 | v71.35,54.25 U1.4 | U1.63 88.07,37.98 | U1.79 91.86,41.24 | 23.63,71.62 IC2.3 21.23,71.62 | U1.19 v74.74,46.74 | U1.41 77.07,37.67 | U1.36 76.2,38.24 | U1.94 95.54,48.74 | U1.95 95.66,49.24 | U1.97 95.53,50.24 | U1.131 81.57,58.85 | 98.42,75.56 96.52,75.56 96.52,74.93 95.73,74.93 | U1.48 80.57,37.93 | U1.57 85.07,37.47 | U1.88 95.91,45.74 | U1.89 96.41,46.24 | U1.90 96.14,46.74 | U1.91 95.64,47.24 | U1.24 73.95,44.25 74.75,45.05 v74.75,45.3 74.69,45.24 U1.22 | U1.118 88.07,56.57 v87.85,56.35 | U1.123 85.57,56.58 v85.8,56.35 | U1.27 74.61,42.74 v74.7,42.65 | IC2.1 21.18,72.62 20.95,72.39 20.95,72.11 v20.85,72 20.97,72.12 IC2.2 | IC2.27 23.13,74.03 22.86,74.3 21.59,74.3 v21.3,74
  Top 0.305: U$2.44 76.06,17.7 v75.85,17.9 | U$2.42 77.66,17.8 v77.7,17.85 | U$2.38 v80.86,17.89 v80.85,17.9 | 95.86,42.74 v96.1,42.5 | 94.52,56.42 v94.61,56.52 | U$2.23 92.86,17.91 v93,18.05 | v80.85,3.69 U$2.7 | v77.67,3.81 77.67,5.18 U$2.3 | 77.07,59.29 v77.47,59.69 | 74.69,42.74 v74.7,42.65 | 88.07,37.98 v88.05,38.44 | 91.86,41.24 v91.45,41.65 | 23.63,71.62 IC2.EXP | IC2.M 22.03,73.27 v21.3,74 | 21.23,71.62 v20.85,72 | v74.74,46.74 v74.75,46.75 | 74.71,45.24 v74.75,45.3 | 77.07,37.67 v77.55,38.15 | 76.2,38.24 v76.33,38.12 | 95.54,48.74 95.95,49.15 95.95,49.53 v96.09,49.68 | 95.66,49.24 v96.09,49.68 | 95.53,50.24 v96.09,49.68 | 81.57,58.85 v80.63,59.79 | JTAG.2 5.08,24.13 14.61,24.13 14.92,23.82 R28.1 | v15.24,52.07 R31.2 | U$16.4 v37.47,51.44 | U$17.4 v37.47,60.33 37.47,62.87 | U$17.1 38.1,64.14 37.47,63.5 37.47,62.87 | U$17.2 37.47,62.87 | U$17.7 v47.62,62.87 | 98.42,75.56 100.33,73.66 100.64,73.66 C28.2 | 95.73,74.93 U$1.3 | 80.57,37.93 v80.55,37.95 | 85.07,37.47 v85.6,38 | 95.91,45.74 v96.52,46.35 | 96.41,46.24 v96.52,46.35 | 96.14,46.74 v96.52,46.35 | 95.64,47.24 v96.52,46.35
  Top 0.406: C27.2 140.01,59.05 U$4.15 135.25,59.05 134.62,59.69 134.62,63.18 C23.2 v135.89,63.5 | v138.43,68.58 138.75,68.89 U$13.2 | R15.1 v119.38,73.66 | R14.1 v119.38,68.58 | U$14.2 138.75,75.25 v138.43,74.93 | JOYPAD2.3 136.75,8.66 133.35,12.06 133.35,16.36 U$20.2 | U$18.2 117.16,10.31 JOYPAD1.3
  Top 0.61: R15.1 120.97,74.61 121.92,75.56 127,75.56 128.91,77.47 128.91,77.95 | v102.87,5.08 102.87,5.4 R43.1 | v105.41,5.08 R41.1 | U$19.2 110.81,14.93 v111.12,14.61 | U$21.2 126.68,14.93 v127,14.61 | C13.2 27.21,64.48 v27.25,64.45 | C14.2 20.32,63.03 v20.4,62.95 | C12.2 17.78,62.83 v17.75,62.8 | C57.2 17.46,4.76 18.41,5.71 21.83,5.71 S1.3 | POWER.C v56.52,74.3 | v61.6,67.3 v61.59,67.31 | 61.6,48.15 61.61,48.16 v61.65,48.16
  Top 0.813: 131.44,93.98 v131.44,90.17 v131.44,88.27 v131.44,86.36 v131.44,80.64 v131.44,79.38 130.34,78.28 U$15.2 | C56.2 36.83,39.37 38.1,38.1 U$12.2 40.55,35.66 v40.64,35.56 | v26.04,13.34 24.37,13.34 S1.4 | v26.04,4.45 24.58,4.45 S1.3
  Top 1.016: 92.08,38.73 v93.98,36.83
  Top 1.27: R8.1 111.44,86.68 110.49,87.63 v110.49,88.27 v110.49,89.53 MIC_OUT.SLEEVE | 149.86,91.44 151.52,89.78 PS2.3 157.25,85.95 158.12,85.09 158.12,75.56 154.94,72.39 154.94,53.98 151.13,50.16 148.59,50.16 147.32,51.44 SERIAL.5 144.78,49.12 144.78,33.41 VGA.6 VGA.7 VGA.8 | 149.86,91.44 147.32,93.98 145.73,93.98 | C7.2 C6.2 56.2,79.69 57.15,78.74 59.69,78.74 64.77,83.82 | C7.2 51.75,79.69 50.8,78.74 45.72,78.74 44.45,80.01 C1.- | U$7.1 52.33,81.86 C7.2 | C2.- 64.77,83.82 | C10.- 67.31,82.55 | 67.31,82.55 66.04,82.55 64.77,83.82 | U$8.1 70.08,82.59 C10.- | U$9.1 80.24,82.59 | 80.24,82.59 C11.- 77.47,85.28 C8.2 | 80.24,82.59 80.24,80.24 78.74,78.74 71.12,78.74 69.85,80.01 69.85,82.36 C10.- | C9.2 67.31,82.55 | MIC_OUT.SLEEVE TAPE_IN.SLEEVE v96.52,89.53 v96.52,88.27 96.52,87.63 97.79,86.36 100.33,86.36 100.97,85.72 100.97,84.14 R17.1 101.39,83.07 U$3.A 102.23,80.01 103.5,78.74 v103.5,76.83 103.5,74.93 102.23,73.66 101.28,73.66 C28.2 | MIC_OUT.SLEEVE TAPE_OUT.SLEEVE 131.44,93.98 AUDIO_OUT.SLEEVE 145.73,93.98 | 145.73,93.98 R5.1 | v88.27,94.61 v88.27,93.34 v88.27,90.17 v88.27,85.09 v88.27,83.82 | 149.86,91.44 v144.78,86.36 v143.51,85.09 | v70.48,67.31 v72.39,67.31 v76.83,67.31 v78.74,67.31 | v80.01,46.99 U1.145 | v83.82,50.8 U1.145 | U1.145 v87.63,46.99 | v83.82,43.18 U1.145 | v151.13,40.64 v154.94,40.64 | v136.53,17.78 v139.06,15.24 | v80.64,23.5 C55.2 | C53.2 v70.48,6.35 v70.48,3.17 | C51.2 v70.48,3.17 | C54.2 v87,2.54 | C52.2 v98.42,4.45 | v103.5,88.9 v103.5,87.63 v103.5,86.36 103.5,81.92 104.14,81.28 | v93.34,73.03 v89.53,73.03 | v63.45,22.05 63.45,22.18 65.41,24.13 | v62.85,30.1 58.15,30.1 58.1,30.15
  Top 1.27: v62.85,26.95 62.85,30.15 | v67.35,30.05 67.35,27 67.3,26.95 | v57.78,38 v61.59,38 | v57.78,58.42 v61.59,58.42 | v91.44,38.73 92.08,38.73 | C43.2 v73.15,64.2 | C29.2 140.64,75.23 v140.34,74.93 | C30.2 120.19,19.52 v119.38,20.32 | v85.09,31.11 v85.09,27.25 | v111.12,26.04 v111.12,29.84 | v118.75,26.04 v118.75,29.84 | v122.56,26.04 v122.56,29.84 | v130.18,26.04 v130.18,29.84 | v103.5,11.6 103.5,8.75 | v8.26,13.97 v11.43,13.97 | v14.61,10.16 v14.61,6.99 | C58.2 v19.05,39.37 | v70.48,3.17 68.82,3.17 BUTTON_0.3 68.29,6 67.94,6.35 58.42,6.35 | 58.42,6.35 47.62,6.35 | 47.62,6.35 40.45,6.35 BUTTON_3.3 | BUTTON_2.3 47.97,6 47.62,6.35 | BUTTON_1.3 58.13,6.06 58.42,6.35 | 57.8,67.35 61.55,67.35 v61.6,67.3 | 57.8,48.15 61.6,48.15
  Top 1.422: 9.17,81.28 J1.2 12.17,91.9 J1.1 19.53,91.9 U$6.P$1 | 9.17,81.28 9.17,80.67 X1.S1 | 26.67,81.28 U$5.1 30.48,80.01 33.02,77.47 39.37,77.47 41.91,80.01 41.91,81.6 | 26.67,81.28 9.17,81.28 | C4.2 26.67,81.28 | C5.2 41.91,81.6 | 41.91,81.6 44.32,81.6 | 44.32,81.6 C1.- | 44.32,81.6 46.04,81.6 46.99,82.55 46.99,88.9 45.72,90.17 44.64,90.17 C3.-
  Bottom 0.305: 69.45,44.85 69.22,45.09 69.22,46.99 69.85,47.62
  Bottom 0.406: v135.89,63.5 138.43,66.04 v138.43,68.58 v138.43,74.93 133.99,79.38 v131.44,79.38 | v119.38,73.66 v119.38,68.58
  Bottom 0.61: VGA.8 148.59,24.77 149.86,23.5 149.86,21.73 VGA.10 | JOYPAD2.3 136.75,8.48 135.25,6.99 128.27,6.99 127,8.26 119.22,8.26 JOYPAD1.3 118.75,8.28 118.75,7.62 118.11,6.99 111.12,6.99 109.86,8.26 109.86,13.34 | v102.87,5.08 v105.41,5.08 105.41,8.89 109.86,13.34 | 109.86,13.34 v111.12,14.61 113.03,16.51 125.73,16.51 127,15.24 v127,14.61
  Bottom 1.27: 137,8.26 138.43,8.26 146.05,15.88 VGA.5 147.45,19.32 VGA.10
  Bottom 1.422: X1.S1 X1.S2
  other vias: 13.75,81.4 18.3,81.4 22.7,81.4 37.8,77.55 40.1,78.15 41.2,79.35 45.6,79.35 48.6,78.75 51.2,79.15 54.05,81.35 57.18,78.75 63.35,82.45 64.75,88.1 80.25,85.1 80.25,80.95 76.9,78.8 73,78.75 103.5,82.35 104.1,81.35 58.15,30.2 67.3,27.05 65.5,24.25 57.78,67.31 57.73,48.16 103.5,8.8
  pour Bottom (isolate 0.305): 1.27,99.06 158.75,99.06 158.75,1.27 1.27,1.27
  pour Top (isolate 0.406): 1.27,99.06 90.17,99.06 90.17,78.74 1.27,78.74
HSYNC
  Top 0.254: U1.100 105.91,51.74
  Top 0.305: 105.91,51.74 126.05,31.6 132.2,31.6 134.3,29.5 134.3,23.5 R18.2
I2C_SCL  (via drill 0.3)
  Top 0.254: U1.143 75.57,60.95
  Top 0.305: U$17.6 v47.62,61.59 | 75.57,60.95 74.3,62.23 v70.48,62.23 | v66.67,62.23 63.5,65.41 v52.7,65.41 52.7,69.85 55.24,72.39 R57.2
  Bottom 0.305: v47.62,61.59 48.9,61.59 v52.7,65.41 | v66.67,62.23 v70.48,62.23
I2C_SDA  (via drill 0.3)
  Top 0.254: U1.144 75.07,60.19
  Top 0.305: U$17.5 v50.16,60.33 | 75.07,60.19 74.3,60.96 v71.75,60.96 | v67.31,60.96 66.67,60.96 63.5,64.14 v54.61,64.14 | R58.2 55.88,69.85 v54.61,68.58
  Bottom 0.305: v50.16,60.33 53.98,64.14 v54.61,64.14 v54.61,68.58 | v67.31,60.96 v71.75,60.96
JP1_CLK
  Top 0.406: R35.2 116.84,19.52 U$18.3 117.64,18.88 118.75,17.78 118.75,11.22 JOYPAD1.5
JP1_CLK_Q
  Top 0.254: 107.15,45.25 94.61,45.25 U1.87
  Top 0.305: 113,24.48 R39.1 113.03,39.37 107.15,45.25
JP1_DATA
  Top 0.406: JOYPAD1.1 116.87,8.29 115.57,6.99 111.12,6.99 107.31,10.79 107.31,13.34 106.68,13.97 105.72,13.97 R40.2
JP1_DATA_D
  Top 0.254: 102.75,44.25 U1.85
  Top 0.305: R40.1 104.61,12.38 103.85,13.15 103.85,43.15 102.75,44.25
  Top 0.406: R41.2 R40.1
JP1_LATCH
  Top 0.406: R34.2 109.22,19.52 U$19.3 111.3,18.88 112.39,17.78 112.39,11.22 JOYPAD1.6
JP1_LATCH_Q
  Top 0.254: 103.85,44.75 94.61,44.75 U1.86
  Top 0.305: R38.1 105.45,24.48 105.45,43.15 103.85,44.75
JP2_CLK
  Top 0.406: R33.2 U$20.3 132.88,18.88 136.53,15.24 136.53,11.22 JOYPAD2.5
JP2_CLK_Q
  Top 0.254: U1.99 105.26,51.24
  Top 0.305: 105.26,51.24 125.7,30.8 125.75,30.8 128.35,28.2 128.35,24.52 R37.1
JP2_DATA
  Top 0.406: JOYPAD2.1 134.65,8.29 133.35,6.99 132.22,6.99 127.77,2.54 102.87,2.54 99.69,5.71 99.69,13.34 100.33,13.97 101.28,13.97 R42.2
JP2_DATA_D
  Top 0.254: 94.61,43.75 U1.84 102.29,43.74 102.3,43.75
  Top 0.305: R42.1 102.78,12.38 103.2,12.8 103.2,42.85 102.3,43.75
  Top 0.406: R43.2 R42.1
JP2_LATCH
  Top 0.406: R32.2 124.46,20.15 U$21.3 126.53,18.88 130.18,15.24 130.18,11.22 JOYPAD2.6
JP2_LATCH_Q
  Top 0.254: U1.98 104.61,50.74
  Top 0.305: 104.61,50.74 120.7,34.65 120.7,24.5 R36.1
LED_0
  Top 0.254: U1.33 71.49,39.74
  Top 0.305: 71.49,39.74 64.14,32.38 55.47,32.38 LED_0.C
LED_1
  Top 0.254: U1.32 71.36,40.24
  Top 0.305: 71.36,40.24 64.14,33.02 53.98,33.02 50.16,29.21 47.84,29.21 LED_1.C
LED_2
  Top 0.254: U1.31 71.22,40.74
  Top 0.305: 71.22,40.74 64.14,33.66 53.98,33.66 50.8,30.48 44.67,30.48 LED_2.C
LED_3
  Top 0.254: U1.30 71.08,41.24
  Top 0.305: 71.08,41.24 64.14,34.29 53.98,34.29 50.8,31.11 40.86,31.11 LED_3.C
N$1  (via drill 0.5)
  Top 0.254: U1.37 75.07,35.42
  Top 0.305: 75.07,35.42 v74.46,34.81
  Bottom 0.305: v74.46,34.81 74.46,34.76
  Bottom 0.61: U$10.1 75.58,33.69 v74.46,34.81 73.16,36.11 C17.1
N$2
  Top 0.254: IC2.5 19.16,70.62
  Top 0.305: 19.16,70.62 X1.2
N$3
  Top 0.254: IC2.4 20.32,71.12
  Top 0.305: 20.32,71.12 15.24,76.2 13.34,76.2 12.87,75.73 X1.3
N$4
  Top 0.254: IC2.9 23.13,68.31
  Top 0.305: 23.13,68.31 24.13,67.31 24.13,66.99 R1.2
N$5
  Top 1.27: R52.2 LED_3.A
N$6  (via drill 0.3)
  Top 0.254: U1.109 92.57,58.97
  Top 0.305: 92.57,58.97 v92.9,59.3
  Bottom 0.305: U$11.1 93.11,59.09 v92.9,59.3
  Bottom 0.61: v92.9,59.3 92.9,58.3 C18.1
N$7
  Top 0.254: IC2.6 20.59,70.12
  Top 0.305: 20.59,70.12 19.68,69.22 19.68,67.31 | 19.68,67.31 18.73,67.31 C12.1 | 19.68,67.31 19.82,67.44 C14.1 21.78,67.44 R1.1
N$8
  Top 0.61: U$13.1 134.16,70.66 130.18,66.67 119.06,66.67 R2.2
N$9
  Top 0.61: U$14.1 136.06,77 130.81,71.75 119.06,71.75 R3.2
N$10
  Top 0.813: U$15.1 123.97,78.28 R4.2
N$11
  Top 1.27: MIC_OUT.TIP 105.49,86.92 107.95,84.45 R8.2 109.09,84 C22.1
N$12
  Top 1.27: R7.2 C20.2 126.36,83.69 126.36,81.92 127.64,80.64 U$15.3
N$13
  Top 0.406: C19.1 94.75,79.5 93.98,78.74 93.98,76.2 94.61,75.56 U$1.2
  Top 1.27: U$3.C C19.1
N$14
  Top 1.27: AUDIO_OUT.TIP 133.43,87.55 134.62,86.36 142.24,86.36 | 142.24,86.36 143.51,87.63 143.51,88.9 AUDIO_OUT.RING 146.05,91.6 R5.2 | C21.1 141.1,85.22 142.24,86.36
N$15
  Top 1.27: C19.2 91.94,83.37 R16.2
N$16
  Top 1.27: TAPE_OUT.TIP 119.46,87.55 120.65,86.36 128.27,86.36 128.91,87 | 128.91,87 129.54,87.63 129.54,88.9 TAPE_OUT.RING | C20.1 129.03,86.86 128.91,87
N$17
  Top 1.27: R6.2 C21.2
N$18
  Top 0.406: R18.1 141.6,20.32 145.41,16.51 151.76,16.51 153.03,17.78 153.03,21.98 VGA.13
N$19
  Top 0.406: VGA.14 152.4,20.32 152.4,18.41 151.76,17.78 145.41,17.78 139.7,23.5 R19.1
N$20
  Top 0.61: R22.2 R23.2 143.27,26.67 VGA.3
N$21
  Top 0.61: R20.2 R21.2 140.97,33.02 142.88,31.11 142.88,29.35 VGA.2
N$22
  Top 0.61: R25.2 R24.2 140.97,39.37 141.6,38.73 141.6,34.29 144.15,31.75 144.15,29.84 145.53,28.46 VGA.1
N$23
  Top 1.27: C22.2 R9.2
N$24
  Top 0.406: U$4.14 145.21,57.78 SERIAL.2
N$25
  Top 0.406: U$4.13 146.69,56.52 SERIAL.3
N$26  (via drill 0.3)
  Top 0.406: U$4.8 v132.72,51.44
  Bottom 0.406: SERIAL.8 137.06,55.78 v132.72,51.44
N$27  (via drill 0.3)
  Top 0.406: U$4.7 v132.72,52.7
  Bottom 0.406: SERIAL.7 138.53,58.52 v132.72,52.7
N$28
  Top 0.406: C23.1 132.4,61.91 133.35,60.96 133.35,55.88 131.44,53.98 U$4.6
N$30
  Top 0.406: U$4.2 131.44,59.05 132.08,59.69 132.08,60.96 130.81,62.23 130.81,64.77 132.08,66.04 C24.2
N$32
  Top 0.406: C25.2 127.95,57.78 U$4.3
N$33
  Top 0.406: C25.1 128.16,61.91 U$4.1
N$34
  Top 0.406: U$4.4 126.05,56.52 C26.1
N$35
  Top 0.406: U$4.5 126.05,55.24 C26.2
N$37
  Top 0.305: R26.2 U$16.2
N$38
  Top 0.813: U$12.3 R27.1
N$39
  Top 1.27: R53.2 LED_2.A
N$40
  Top 1.27: R54.2 LED_1.A
N$41
  Top 1.27: R55.2 LED_0.A
N$42
  Top 0.406: R39.2 113.03,18.91 U$18.1
N$43
  Top 0.406: R38.2 105.41,20.18 U$19.1
N$44
  Top 0.406: R37.2 128.27,18.41 130.18,16.51 130.96,16.51 U$20.1
N$45
  Top 0.406: R36.2 120.65,20.81 U$21.1
N$46
  Top 0.61: POWER.A R56.2
N$50
  Top 0.254: U1.9 69.26,51.74 67.6,53.4 63.96,53.4 R45.2
PS2_CLK
  Top 0.61: PS2.5 148.5,85.95 R11.2 144.47,81.92 142.88,81.92 140.16,79.2 U$14.3 137.62,79.38 135.25,79.38 129.54,73.66 R13.2
PS2_CLK_D  (via drill 0.5)
  Top 0.254: U1.120 87.07,60.42 87.6,60.95 87.6,66.64 87.63,66.67
  Top 0.305: 121.6,65.55 v121.65,65.6 121.45,65.41 114.94,65.41 113.67,66.67 113.67,68.58 113.03,69.22 90.17,69.22 87.63,66.67
  Top 0.61: R15.2 v124.46,73.66 R13.1
  Bottom 0.305: v121.65,65.6 121.65,70.85 v124.46,73.66
PS2_CLK_Q
  Top 0.254: U1.124 85.07,65.39
  Top 0.305: 85.07,65.39 90.17,70.48 111.12,70.48 114.3,73.66 R3.1
PS2_DATA
  Top 0.61: PS2.1 152.37,83.85 153.03,83.19 153.03,77.47 151.13,75.56 145.09,75.56 R10.2 144.46,74.93 142.88,74.93 140.8,72.86 U$13.3 137.62,73.03 133.99,73.03 129.54,68.58 R12.2
PS2_DATA_D  (via drill 0.5)
  Top 0.254: U1.119 87.57,60.27 88.05,60.75 88.05,66.46 88.14,66.56
  Top 0.305: 88.14,66.56 90.17,68.58 112.39,68.58 113.03,67.94 113.03,66.67 114.94,64.77 115.3,64.4 123.45,64.4 v124.46,65.41
  Top 0.61: R14.2 v124.46,68.58 R12.1
  Bottom 0.305: v124.46,65.41 v124.46,68.58
PS2_DATA_Q
  Top 0.254: U1.121 86.57,60.52 87.1,61.05 87.1,66.78 87.11,66.79
  Top 0.305: 87.11,66.79 90.17,69.85 113.98,69.85 R2.1
R0
  Top 0.254: 92.71,60.33 92.05,59.66 92.07,59.65 U1.110
  Top 0.305: R24.1 124.68,39.37 103.72,60.33 92.71,60.33
R1
  Top 0.254: 91.65,60.3 91.57,60.22 U1.111
  Top 0.305: R25.1 122.56,42.55 104.14,60.96 92.31,60.96 91.65,60.3
RESET
  Top 0.254: U1.25 71.44,43.74 70.85,43.15
  Top 0.305: 70.85,43.15 66.73,43.15 64.01,40.43 57.25,40.43 50.79,34.3 50.78,34.29 36.83,34.29 27.3,24.77 27.3,15.24
  Top 0.61: C57.1 16.51,9.97 S1.2 19.34,13.62 20.95,15.24 27.3,15.24 27.94,14.61 R44.1
RTS
  Top 0.254: U1.112 91.07,60.59
  Top 0.305: U$4.9 136.95,49.95 134.62,47.62 118.75,47.62 104.78,61.59 92.08,61.59 91.07,60.59
RW
  Top 0.254: U1.69 91.07,34.02
  Top 0.305: U$2.12 84.86,8.65 87.63,11.43 93.34,11.43 93.98,12.06 93.98,31.11 91.07,34.02
RXD
  Top 0.254: U1.115 89.57,61.92
  Top 0.305: U$4.12 135.25,55.24 133.99,53.98 133.99,50.8 132.72,49.53 125.09,49.53 125.08,49.55 119.95,49.55 105.9,63.6 91.25,63.6 89.57,61.92
SDRAM_CLK
  Top 0.254: 84.07,32.63 U1.55
  Top 0.305: U$2.32 85.7,16.44 85.7,25.1 82.8,28 82.8,31.36 84.07,32.63
TAPE_IN
  Top 0.254: 83.55,68.5 83.57,68.48 U1.127
  Top 0.305: U$1.4 97.32,74.46 97.16,74.3 89.34,74.3 83.55,68.5
TAPE_OUT
  Top 0.254: U1.125 84.57,65.52
  Top 0.305: R9.1 117,80.49 117,78.65 109.47,71.12 90.17,71.12 84.57,65.52
  Top 1.27: R9.1 119.7,80.64 R4.1
TCK  (via drill 0.5)
  Top 0.254: U1.16 69.98,48.24
  Top 0.305: 69.98,48.24 68.73,46.99 64.14,46.99 63.5,46.35 36.83,46.35 20.95,30.48 12.06,30.48 v11.43,29.84 | R28.2 v11.43,22.86 JTAG.1
  Bottom 0.305: v11.43,29.84 v11.43,22.86
TDI
  Top 0.254: U1.15 69.69,48.74
  Top 0.305: 69.69,48.74 68.58,47.62 63.5,47.62 62.87,46.99 36.2,46.99 20.95,31.75 13.34,31.75 12.7,32.38 12.7,32.7 R30.2 JTAG.9
TDO
  Top 0.254: U1.20 70.42,46.24
  Top 0.305: 70.42,46.24 69.27,45.09 65.41,45.09 64.14,43.81 47.62,43.81 46.35,45.09 38.1,45.09 18.41,25.4 JTAG.3
TMS
  Top 0.254: U1.18 70.6,47.24
  Top 0.305: 70.6,47.24 69.08,45.72 64.77,45.72 63.5,44.45 48.26,44.45 46.99,45.72 37.47,45.72 20.95,29.21 13.97,29.21 13.34,28.57 13.34,28.25 R29.2 JTAG.5
TXD
  Top 0.254: U1.114 90.07,61.57
  Top 0.305: U$4.11 135.25,53.98 134.62,53.34 134.62,50.16 133.35,48.9 123.19,48.9 119.55,48.9 105.45,63 91.5,63 90.07,61.57
VBUS  (via drill 0.3, 0.5)
  Top 0.254: IC2.7 21.45,69.62 v20.9,69.06 | IC2.8 21.14,68.82
  Top 0.305: 21.14,68.82 v20.9,69.06
  Top 0.61: v22.05,65.05 23.25,65.05 C13.1
  Bottom 0.61: X1.1 15.24,72.04 15.24,71.12 17.3,69.06 v20.9,69.06 22.05,67.92 v22.05,65.05
VHIGH
  Top 1.422: U$6.P$2 24.86,93.23 D1.C 26.13,85.09 26.67,85.09 | U$5.3 35.56,82.55 33.02,85.09 26.67,85.09 | C4.1 26.67,85.09
VIN
  Top 1.422: D1.A 14.43,86.36 J1.3
VSYNC
  Top 0.254: U1.101 106.51,52.24
  Top 0.305: 106.51,52.24 126.36,32.38 132.72,32.38 135.25,29.84 135.25,24.77 136.53,23.5 R19.2
~CAS
  Top 0.254: U1.70 91.57,34.16
  Top 0.305: U$2.13 85.66,8.19 88.27,10.79 93.98,10.79 94.61,11.43 94.61,31.11 91.57,34.16
~CE  (via drill 0.5)
  Top 0.254: U1.21 70.81,45.74
  Top 0.305: 70.81,45.74 69.52,44.45 66.04,44.45 64.77,43.18 54.61,43.18 v53.98,42.55 | AS.6 5.08,52.07 R31.1 11.43,51.75 11.43,50.8 13.34,48.9 v53.98,48.9
  Bottom 0.305: v53.98,48.9 v53.98,42.55
~CONFIG
  Top 0.254: U1.14 67.87,49.24 66.6,49.24 R46.2 66.28,49.92 65.41,50.8 57.78,50.8
  Top 0.305: 57.78,50.8 54.61,47.62 12.7,47.62 9.53,50.8 AS.5
~CS
  Top 0.254: U1.72 92.57,34.43
  Top 0.305: U$2.15 87.25,7.25 89.53,9.53 95.25,9.53 95.89,10.16 95.89,31.11 92.57,34.43
~CSO
  Top 0.254: U1.8 69.5,52.24 67.12,54.61 65.41,54.61
  Top 0.305: 65.41,54.61 52.7,54.61 50.8,56.52 41.06,56.52 U$16.1 7.62,55.24 6.99,54.61 4.45,54.61 3.81,53.98 AS.8
~RAS
  Top 0.254: U1.71 92.07,34.3
  Top 0.305: U$2.14 86.45,7.71 88.9,10.16 94.61,10.16 95.25,10.79 95.25,31.11 92.07,34.3